# EAGLE design SND_SMD_Replacement (EAGLE 9.6.2)
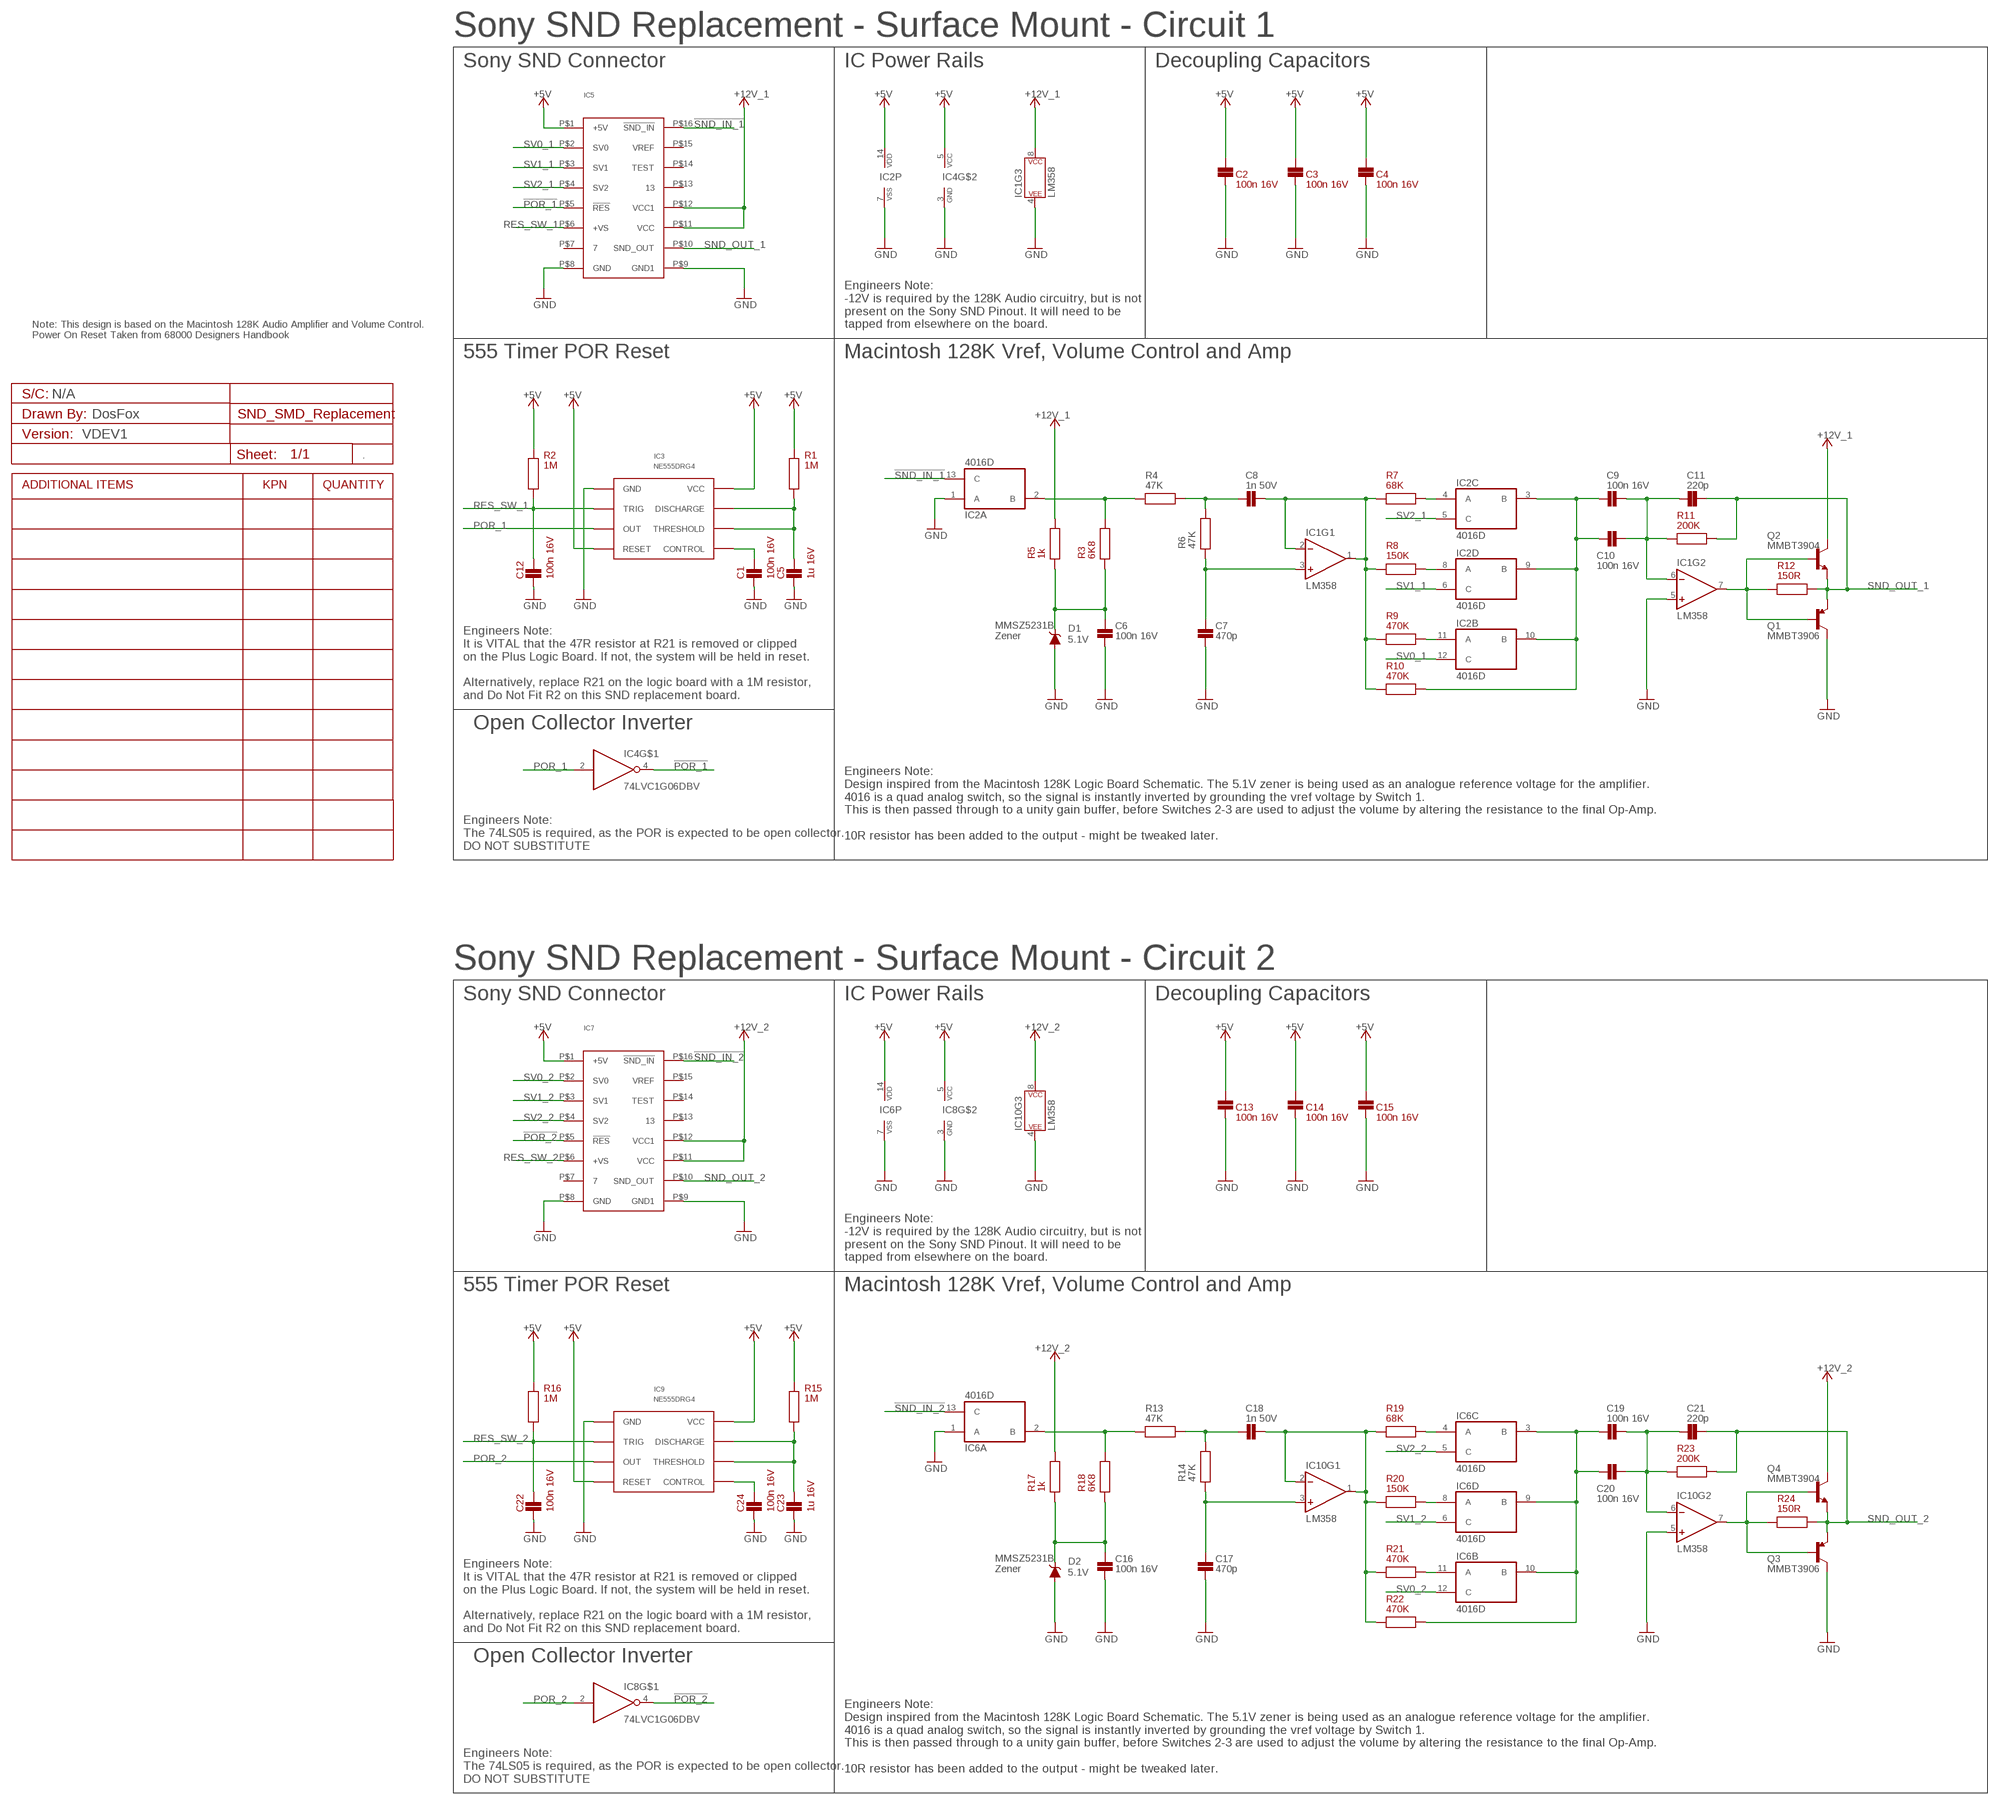
[diagram p0: schematic, sheet 1]

## Parts
A1  VDEV1  PROJECT_DETAILS_CUSTOM  [PCB_CUSTOM_DETAILS]
C1  100n 16V  100N_CAP_0603  [C0603]
C2  100n 16V  100N_CAP_0603  [C0603]
C3  100n 16V  100N_CAP_0603  [C0603]
C4  100n 16V  100N_CAP_0603  [C0603]
C5  1u 16V  1U_CAP_0603  [C0603]
C6  100n 16V  100N_CAP_0603  [C0603]
C7  470p  100P_CAP_0603  [C0603]
C8  1n 50V  10N_CAP_0603  [C0603]
C9  100n 16V  100N_CAP_0603  [C0603]
C10  100n 16V  100N_CAP_0603  [C0603]
C11  220p  100P_CAP_0603  [C0603]
C12  100n 16V  100N_CAP_0603  [C0603]
C13  100n 16V  100N_CAP_0603  [C0603]
C14  100n 16V  100N_CAP_0603  [C0603]
C15  100n 16V  100N_CAP_0603  [C0603]
C16  100n 16V  100N_CAP_0603  [C0603]
C17  470p  100P_CAP_0603  [C0603]
C18  1n 50V  10N_CAP_0603  [C0603]
C19  100n 16V  100N_CAP_0603  [C0603]
C20  100n 16V  100N_CAP_0603  [C0603]
C21  220p  100P_CAP_0603  [C0603]
C22  100n 16V  100N_CAP_0603  [C0603]
C23  1u 16V  1U_CAP_0603  [C0603]
C24  100n 16V  100N_CAP_0603  [C0603]
D1  5.1V  DIODE-ZENER-MMSZ5232BS  [SOD-323]
D2  5.1V  DIODE-ZENER-MMSZ5232BS  [SOD-323]
IC1  LM358  OPAMP-DUALU  [SO08]
IC2  4016D  [SO14]
IC3  NE555DRG4  555_SOIC8  [SOIC8]
IC4  74LVC1G06DBV  [SOT23-5]
IC5  SND  [DIP16]
IC6  4016D  [SO14]
IC7  SND  [DIP16]
IC8  74LVC1G06DBV  [SOT23-5]
IC9  NE555DRG4  555_SOIC8  [SOIC8]
IC10  LM358  OPAMP-DUALU  [SO08]
Q1  MMBT3906  TRANS_PNP-PMBT3906|MMBT3906L  [SOT23-3]
Q2  MMBT3904  TRANS_NPN-MMBT2222AL  [SOT23-3]
Q3  MMBT3906  TRANS_PNP-PMBT3906|MMBT3906L  [SOT23-3]
Q4  MMBT3904  TRANS_NPN-MMBT2222AL  [SOT23-3]
R1  1M  GENERIC_RESISTOR_0603  [R0603]
R2  1M  GENERIC_RESISTOR_0603  [R0603]
R3  6K8  GENERIC_RESISTOR_0603  [R0603]
R4  47K  47K_RESISTOR  [R0603]
R5  1k  1K_RESISTOR_0603  [R0603]
R6  47K  47K_RESISTOR  [R0603]
R7  68K  GENERIC_RESISTOR_0603  [R0603]
R8  150K  GENERIC_RESISTOR_0603  [R0603]
R9  470K  GENERIC_RESISTOR_0603  [R0603]
R10  470K  GENERIC_RESISTOR_0603  [R0603]
R11  200K  GENERIC_RESISTOR_0603  [R0603]
R12  150R  150R_RESISTOR_0603  [R0603]
R13  47K  47K_RESISTOR  [R0603]
R14  47K  47K_RESISTOR  [R0603]
R15  1M  GENERIC_RESISTOR_0603  [R0603]
R16  1M  GENERIC_RESISTOR_0603  [R0603]
R17  1k  1K_RESISTOR_0603  [R0603]
R18  6K8  GENERIC_RESISTOR_0603  [R0603]
R19  68K  GENERIC_RESISTOR_0603  [R0603]
R20  150K  GENERIC_RESISTOR_0603  [R0603]
R21  470K  GENERIC_RESISTOR_0603  [R0603]
R22  470K  GENERIC_RESISTOR_0603  [R0603]
R23  200K  GENERIC_RESISTOR_0603  [R0603]
R24  150R  150R_RESISTOR_0603  [R0603]

## Nets
!POR_1: IC4.4(O) IC5.P$5(!RES)
!POR_2: IC7.P$5(!RES) IC8.4(O)
!SND_IN_1: IC2.13(A:C) IC5.P$16(!SND_IN)
!SND_IN_2: IC6.13(A:C) IC7.P$16(!SND_IN)
+5V: C2.2 C3.2 C4.2 C13.2 C14.2 C15.2 IC2.14(P:VDD) IC3.P$4(RESET) IC3.P$8(VCC) IC4.5(VCC) IC5.P$1(+5V) IC6.14(P:VDD) IC7.P$1(+5V) IC8.5(VCC) IC9.P$4(RESET) IC9.P$8(VCC) R1.2 R2.2 R15.2 R16.2 ; supply symbol labelled VCC
+12V_1: IC1.8(P$V+) IC5.P$11(VCC) IC5.P$12(VCC1) Q2.3(C) R5.2 ; supply symbol labelled VCC
+12V_2: IC7.P$11(VCC) IC7.P$12(VCC1) IC10.8(P$V+) Q4.3(C) R17.2 ; supply symbol labelled VCC
GND: C1.1 C2.1 C3.1 C4.1 C5.1 C6.1 C7.1 C12.1 C13.1 C14.1 C15.1 C16.1 C17.1 C22.1 C23.1 C24.1 D1.A D2.A IC1.4(P$V-) IC1.5(+IN) IC2.1(A:A) IC2.7(P:VSS) IC3.P$1(GND) IC4.3(GND) IC5.P$8(GND) IC5.P$9(GND1) IC6.1(A:A) IC6.7(P:VSS) IC7.P$8(GND) IC7.P$9(GND1) IC8.3(GND) IC9.P$1(GND) IC10.4(P$V-) IC10.5(+IN) Q1.3(C) Q3.3(C)
N$1: IC2.2(A:B) R3.2 R4.1
N$2: C19.1 C20.1 IC6.3(C:B) IC6.9(D:B) IC6.10(B:B) R22.2
N$3: C9.1 C10.1 IC2.3(C:B) IC2.9(D:B) IC2.10(B:B) R10.2
N$4: C8.1 R4.2 R6.2
N$5: C6.2 D1.C R3.1 R5.1
N$6: C7.2 IC1.3(+IN) R6.1
N$7: IC2.4(C:A) R7.2
N$8: IC2.8(D:A) R8.2
N$9: IC2.11(B:A) R9.2
N$10: C9.2 C10.2 C11.1 IC1.6(-IN) R11.1
N$11: C5.2 IC3.P$6(THRESHOLD) IC3.P$7(DISCHARGE) R1.1
N$12: C8.2 IC1.1(OUT) IC1.2(-IN) R7.1 R8.1 R9.1 R10.1
N$13: IC6.2(A:B) R13.1 R18.2
N$14: C18.1 R13.2 R14.2
N$15: IC1.7(OUT) Q1.1(B) Q2.1(B) R12.1
N$16: C16.2 D2.C R17.1 R18.1
N$17: C1.2 IC3.P$5(CONTROL)
N$18: C17.2 IC10.3(+IN) R14.1
N$19: IC6.4(C:A) R19.2
N$20: IC6.8(D:A) R20.2
N$21: IC6.11(B:A) R21.2
N$22: C19.2 C20.2 C21.1 IC10.6(-IN) R23.1
N$23: IC10.7(OUT) Q3.1(B) Q4.1(B) R24.1
N$24: C18.2 IC10.1(OUT) IC10.2(-IN) R19.1 R20.1 R21.1 R22.1
N$25: C23.2 IC9.P$6(THRESHOLD) IC9.P$7(DISCHARGE) R15.1
N$26: C24.2 IC9.P$5(CONTROL)
POR_1: IC3.P$3(OUT) IC4.2(I)
POR_2: IC8.2(I) IC9.P$3(OUT)
RES_SW_1: C12.2 IC3.P$2(TRIG) IC5.P$6(+VS) R2.1
RES_SW_2: C22.2 IC7.P$6(+VS) IC9.P$2(TRIG) R16.1
SND_OUT_1: C11.2 IC5.P$10(SND_OUT) Q1.2(E) Q2.2(E) R11.2 R12.2
SND_OUT_2: C21.2 IC7.P$10(SND_OUT) Q3.2(E) Q4.2(E) R23.2 R24.2
SV0_1: IC2.12(B:C) IC5.P$2(SV0)
SV0_2: IC6.12(B:C) IC7.P$2(SV0)
SV1_1: IC2.6(D:C) IC5.P$3(SV1)
SV1_2: IC6.6(D:C) IC7.P$3(SV1)
SV2_1: IC2.5(C:C) IC5.P$4(SV2)
SV2_2: IC6.5(C:C) IC7.P$4(SV2)
Unconnected: IC5.P$7 IC5.P$13 IC5.P$14(TEST) IC5.P$15(VREF) IC7.P$7 IC7.P$13 IC7.P$14(TEST) IC7.P$15(VREF)

## Notes on the sheet
- Sony SND Replacement - Surface Mount - Circuit 1
- Sony SND Connector | IC Power Rails | Decoupling Capacitors
- Engineers Note:
  -12V is required by the 128K Audio circuitry, but is not 
  present on the Sony SND Pinout. It will need to be 
  tapped from elsewhere on the board.
- Note: This design is based on the Macintosh 128K Audio Amplifier and Volume Control. 
  Power On Reset Taken from 68000 Designers Handbook
- 555 Timer POR Reset | Macintosh 128K Vref, Volume Control and Amp
- N/A
- DosFox
- MMSZ5231B
  Zener
- Engineers Note:
  It is VITAL that the 47R resistor at R21 is removed or clipped
  on the Plus Logic Board. If not, the system will be held in reset. 
  
  Alternatively, replace R21 on the logic board with a 1M resistor,
  and Do Not Fit R2 on this SND replacement board.
- Open Collector Inverter
- Engineers Note:
  Design inspired from the Macintosh 128K Logic Board Schematic. The 5.1V zener is being used as an analogue reference voltage for the amplifier. 
  4016 is a quad analog switch, so the signal is instantly inverted by grounding the vref voltage by Switch 1. 
  This is then passed through to a unity gain buffer, before Switches 2-3 are used to adjust the volume by altering the resistance to the final Op-Amp. 
  
  10R resistor has been added to the output - might be tweaked later.
- Engineers Note:
  The 74LS05 is required, as the POR is expected to be open collector.
  DO NOT SUBSTITUTE
- Sony SND Replacement - Surface Mount - Circuit 2
- Sony SND Connector | IC Power Rails | Decoupling Capacitors
- Engineers Note:
  -12V is required by the 128K Audio circuitry, but is not 
  present on the Sony SND Pinout. It will need to be 
  tapped from elsewhere on the board.
- 555 Timer POR Reset | Macintosh 128K Vref, Volume Control and Amp
- MMSZ5231B
  Zener
- Engineers Note:
  It is VITAL that the 47R resistor at R21 is removed or clipped
  on the Plus Logic Board. If not, the system will be held in reset. 
  
  Alternatively, replace R21 on the logic board with a 1M resistor,
  and Do Not Fit R2 on this SND replacement board.
- Open Collector Inverter
- Engineers Note:
  Design inspired from the Macintosh 128K Logic Board Schematic. The 5.1V zener is being used as an analogue reference voltage for the amplifier. 
  4016 is a quad analog switch, so the signal is instantly inverted by grounding the vref voltage by Switch 1. 
  This is then passed through to a unity gain buffer, before Switches 2-3 are used to adjust the volume by altering the resistance to the final Op-Amp. 
  
  10R resistor has been added to the output - might be tweaked later.
- Engineers Note:
  The 74LS05 is required, as the POR is expected to be open collector.
  DO NOT SUBSTITUTE

## Library data of the parts
A1 = Schematic Symbols:PROJECT_DETAILS
C1-C4 C6 C9 C10 C12-C16 C19 C20 C22 C24 = Capacitors SMD:100N_CAP; COMPONENT: Capacitor; COST: =(INDIRECT(ADDRESS(ROW(),1)))*(INDIRECT(ADDRESS(ROW(),13))); EA: =VLOOKUP(INDIRECT(ADDRESS(ROW(),7)),[ProductCosts.xlsx]StockCosts!$A:$B,2,FALSE); KPN: 3106-100N; PACKAGE: 0603; PROCESS: SMD
C5 C23 = Capacitors SMD:1U_CAP; COMPONENT: Capacitor; COST: =(INDIRECT(ADDRESS(ROW(),1)))*(INDIRECT(ADDRESS(ROW(),13))); EA: =VLOOKUP(INDIRECT(ADDRESS(ROW(),7)),[ProductCosts.xlsx]StockCosts!$A:$B,2,FALSE); KPN: 3106-1U; PACKAGE: 0603; PROCESS: SMD
C7 C11 C17 C21 = Capacitors SMD:100P_CAP; COMPONENT: Capacitor; COST: =(INDIRECT(ADDRESS(ROW(),1)))*(INDIRECT(ADDRESS(ROW(),13))); EA: =VLOOKUP(INDIRECT(ADDRESS(ROW(),7)),[ProductCosts.xlsx]StockCosts!$A:$B,2,FALSE); KPN: xxxx; PACKAGE: 0603; PROCESS: SMD; VALUE: 100p
C8 C18 = Capacitors SMD:10N_CAP; COMPONENT: Capacitor; COST: =(INDIRECT(ADDRESS(ROW(),1)))*(INDIRECT(ADDRESS(ROW(),13))); EA: =VLOOKUP(INDIRECT(ADDRESS(ROW(),7)),[ProductCosts.xlsx]StockCosts!$A:$B,2,FALSE); KPN: 3106-10N; PACKAGE: 0603; PROCESS: SMD; VALUE: 10n 50V
D1 D2 = SparkFun-DiscreteSemi:DIODE-ZENER: Zener Diode A Zener diode allows current to flow from its anode to its cathode like a normal semiconductor diode, but it also permits current to flow in the reverse direction when its "Zener voltage" is reached. - WIkipedia; PROD_ID: DIO-12442; VALUE: 5.6V
IC1 IC10 = SparkFun-IC-Amplifiers:OPAMP-DUAL: Generic op-amp footprint This component is for the standard 358 pinning of a dual op-amp From the LM358 datasheet: Pin 1: Output A Pin 2: Inverting Input A Pin 3: Non-Inverting Input A Pin 4: Gnd Pin 5: Non-Inverting Input B Pin 6: Inverting Input B Pin 7: Output B Pin 8: V+; PROD_ID: NA-XXXXX; VALUE: OP-AMP
IC2 IC6 = 40xx:4016: Quad bilateral ANALOG SWITCH
IC3 IC9 = ICs:555; COMPONENT: 555 Timer; COST: =(INDIRECT(ADDRESS(ROW(),1)))*(INDIRECT(ADDRESS(ROW(),13))); EA: =VLOOKUP(INDIRECT(ADDRESS(ROW(),7)),[ProductCosts.xlsx]StockCosts!$A:$B,2,FALSE); KPN: xxxxx; MANUFACTURE: Texas Instruments; PACKAGE: SOIC8; PROCESS: SMD
IC4 IC8 = 74xx-little-us:74*1G06: Single Inverter Buffer/Driver With Open-Drain Output
IC5 IC7 = ICs:SND; PACKAGE: DIP16; PROCESS: TH
Q1 Q3 = SparkFun-DiscreteSemi:TRANS_PNP: PNP transistor Current controlled devices typically used to amplify current or used as a switch. SparkFun Products: SparkFun Serial Enabled 16x2 LCD - Red on Black <https://www.sparkfun.com/products/9068> SparkFun Logomatic <https://www.sparkfun.com/products/12772>; PROD_ID: TRANS-08052; VALUE: 200mA/40V
Q2 Q4 = SparkFun-DiscreteSemi:TRANS_NPN: NPN transistor Current controlled devices typically used to amplify current or used as a switch. BC547 - COM-08928 <http://www.sparkfun.com/products/8928> (TO-92 45V 100mA) (1.Collector 2.Base 3.Emitter) 2N3904 - COM-00521 <http://www.sparkfun.com/products/521> (TO-92 40V 200mA) (1.Emitter 2.Base 3.Collector) P2N2222A - COM-12852 <http://www.sparkfun.com/products/12852> (TO-92 40V 600mA) (1.Collector 2.Base 3.Emitter); PROD_ID: TRANS-08049; VALUE: 600mA/40V
R1-R3 R7-R11 R15 R16 R18-R23 = Resistors SMD:GENERIC_RESISTOR; COMPONENT: Resistor; COST: =(INDIRECT(ADDRESS(ROW(),1)))*(INDIRECT(ADDRESS(ROW(),13))); EA: =VLOOKUP(INDIRECT(ADDRESS(ROW(),7)),[ProductCosts.xlsx]StockCosts!$A:$B,2,FALSE); PACKAGE: 0603; PROCESS: SMD
R4 R6 R13 R14 = Resistors SMD:47K_RESISTOR; COMPONENT: Resistor; COST: =(INDIRECT(ADDRESS(ROW(),1)))*(INDIRECT(ADDRESS(ROW(),13))); EA: =VLOOKUP(INDIRECT(ADDRESS(ROW(),7)),[ProductCosts.xlsx]StockCosts!$A:$B,2,FALSE); KPN: 3014-47K; PACKAGE: 0603; PROCESS: SMD
R5 R17 = Resistors SMD:1K_RESISTOR; COMPONENT: Resistor; COST: =(INDIRECT(ADDRESS(ROW(),1)))*(INDIRECT(ADDRESS(ROW(),13))); EA: =VLOOKUP(INDIRECT(ADDRESS(ROW(),7)),[ProductCosts.xlsx]StockCosts!$A:$B,2,FALSE); KPN: 3014-1K; PACKAGE: 0603; PROCESS: SMD
R12 R24 = Resistors SMD:150R_RESISTOR; COMPONENT: Resistor; COST: =(INDIRECT(ADDRESS(ROW(),1)))*(INDIRECT(ADDRESS(ROW(),13))); EA: =VLOOKUP(INDIRECT(ADDRESS(ROW(),7)),[ProductCosts.xlsx]StockCosts!$A:$B,2,FALSE); KPN: 3013-150R; PACKAGE: 0603; PROCESS: SMD

## Board
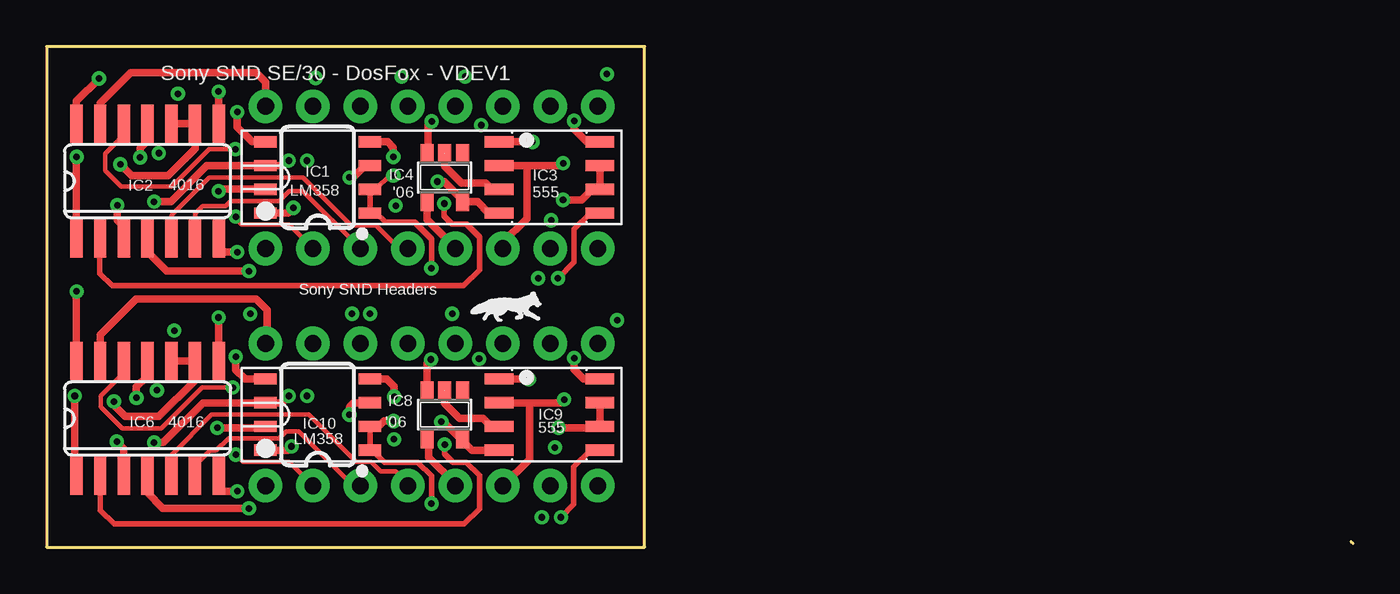
[diagram p1: board, top side]
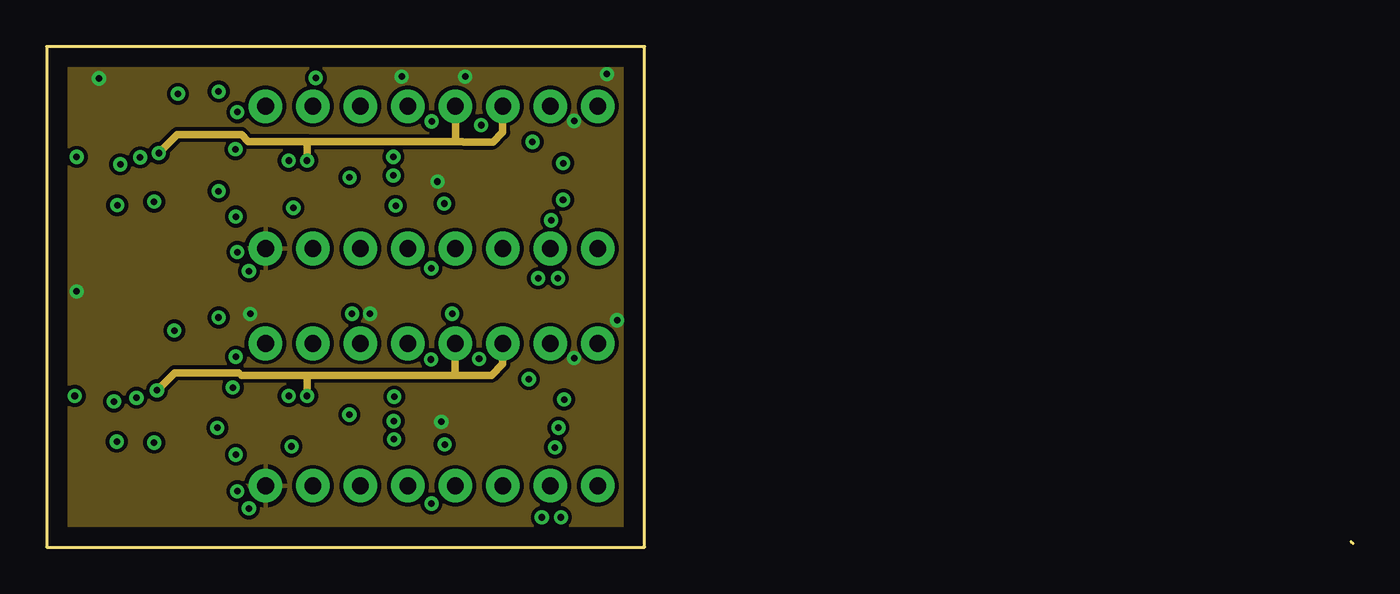
[diagram p2: board, inner layer Route2]
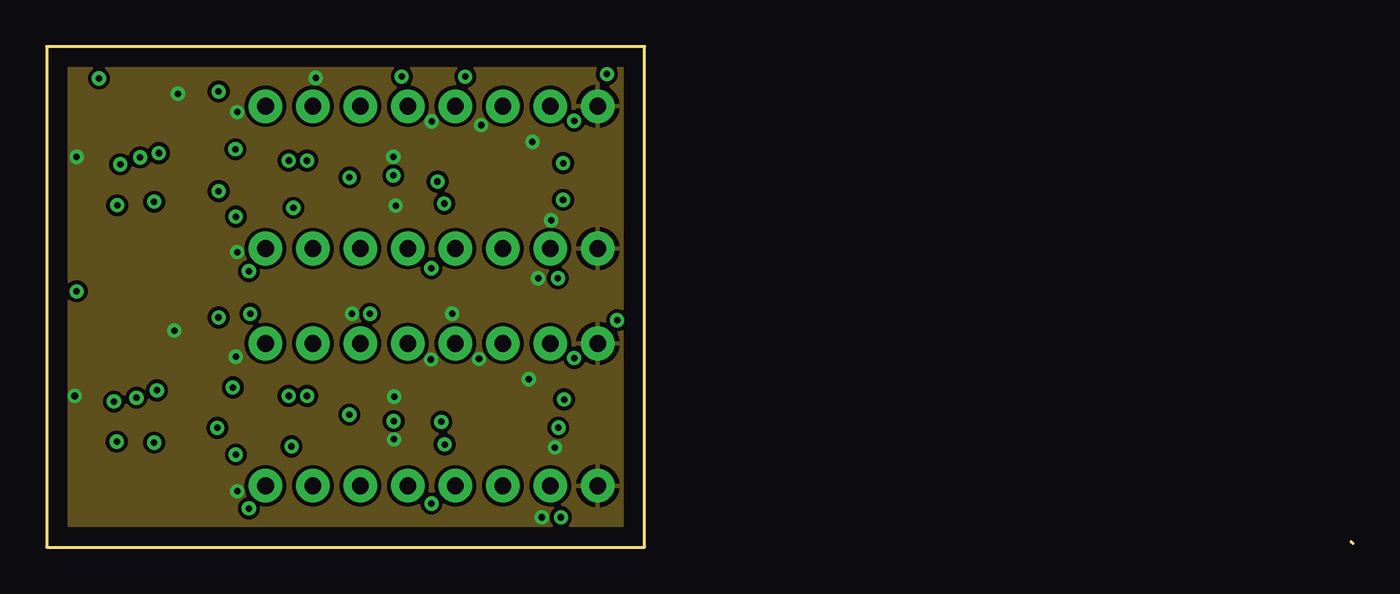
[diagram p3: board, inner layer Route15]
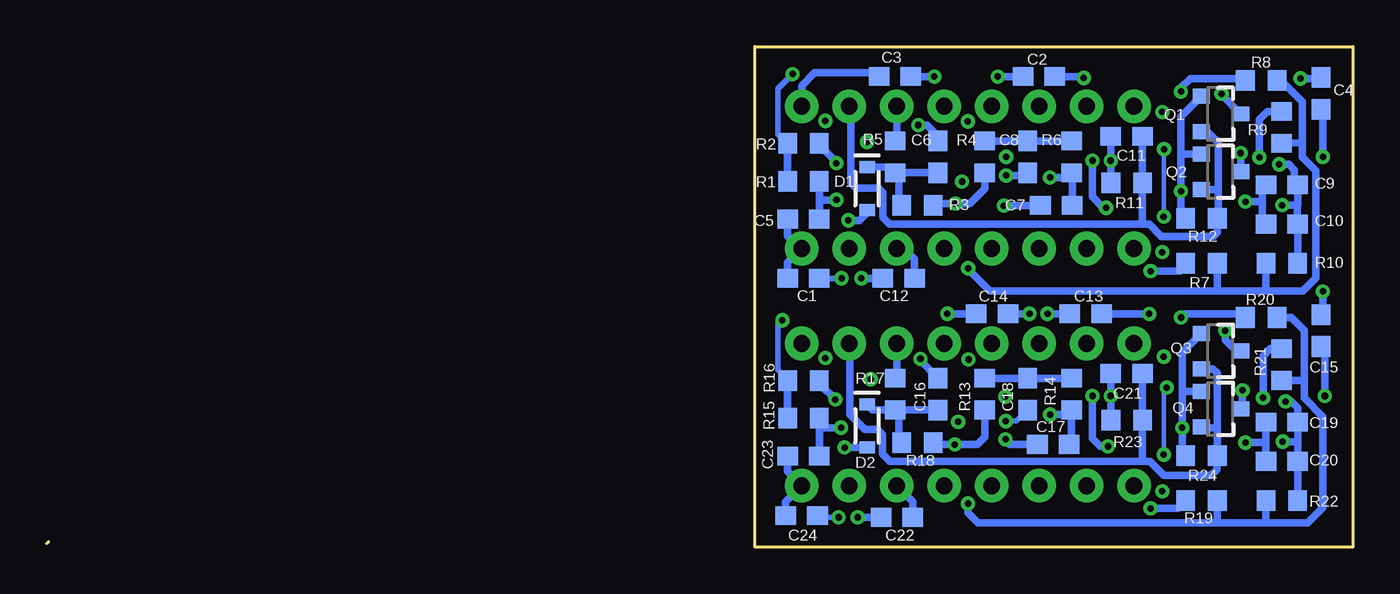
[diagram p4: board, bottom side, seen from below]

Size 69.9 x 26.8 mm. Coordinates in mm from the lower left corner, seen from the top.
Outline: 69.8,0.3 69.9,0.2
Outline: 0,0 32,0 32,26.8 0,26.8 0,0
Copper layers (1+2*15+16): Top 0.035mm / dielectric 1.5mm / Route2 0.035mm / dielectric 0.15mm / Route15 0.035mm / dielectric 0.2mm / Bottom 0.035mm
Design rules "default *": minimum track width 0.2mm, minimum drill 0.25mm, track to track 8mil, track to pad 8mil, pad to pad 8mil, via to via 8mil, smd to smd 8mil, copper to edge 40mil, drill to drill 8mil, minimum pad ring 1mil, minimum via ring 8mil, stop-mask expansion 4mil, vias tented up to drill 1mm, thermal gap 10mil

### Footprints (pad centres in the part's own frame; a part is rotated, then mirrored left to right if it is on the bottom)
C0603 = smd 1.1 x 1: 1 -0.85,0; 2 0.85,0
SOD-323 = smd 0.63 x 0.83: A 1.15,0; C -1.15,0
SO08 = smd 0.6 x 1.2: 1 -1.905,-2.8; 2 -0.635,-2.8; 3 0.635,-2.8; 4 1.905,-2.8; 5 1.905,2.8; 6 0.635,2.8; 7 -0.635,2.8; 8 -1.905,2.8
SO14 = smd 0.66 x 2.032: 1 -3.81,-3.073; 2 -2.54,-3.073; 3 -1.27,-3.073; 4 0,-3.073; 5 1.27,-3.073; 6 2.54,-3.073; 7 3.81,-3.073; 8 3.81,3.073; 9 2.54,3.073; 10 1.27,3.073; 11 0,3.073; 12 -1.27,3.073; 13 -2.54,3.073; 14 -3.81,3.073
SOIC8 = smd 1.55 x 0.6: P$1 -2.7,1.905; P$2 -2.7,0.635; P$3 -2.7,-0.635; P$4 -2.7,-1.905; P$5 2.7,-1.905; P$6 2.7,-0.635; P$7 2.7,0.635; P$8 2.7,1.905
SOT23-5 = smd 0.69 x 0.99: 1 -0.95,-1.29; 2 0,-1.29; 3 0.95,-1.29; 4 0.95,1.3; 5 -0.95,1.3
DIP16 = drill 0.9 pad 1.8: P$1 -8.89,-3.81; P$2 -6.35,-3.81; P$3 -3.81,-3.81; P$4 -1.27,-3.81; P$5 1.27,-3.81; P$6 3.81,-3.81; P$7 6.35,-3.81; P$8 8.89,-3.81; P$9 8.89,3.81; P$10 6.35,3.81; P$11 3.81,3.81; P$12 1.27,3.81; P$13 -1.27,3.81; P$14 -3.81,3.81; P$15 -6.35,3.81; P$16 -8.89,3.81
SOT23-3 = smd 0.8 x 0.9: 1 -0.95,-1; 2 0.95,-1; 3 0,1.1
R0603 = smd 1 x 1.1: 1 -0.85,0; 2 0.85,0

### Placement (x,y rotation side)
A1  -120.65,1.67 0 top  (outside the outline)
C1  29.4,14.4 0 bottom
C2  16.8,25.2 180 bottom
C3  24.5,25.2 0 bottom
C4  1.7,24.3 90 bottom
C5  29.4,17.57 0 bottom
C6  22.2,20.9 270 bottom
C7  15.87,18.3 0 bottom
C8  17.4,20.9 270 bottom
C9  3.8,19.4 180 bottom
C10  3.8,17.3 180 bottom
C11  12.1,22 0 bottom
C12  24.3,14.4 0 bottom
C13  14.3,12.5 0 bottom
C14  19.3,12.5 0 bottom
C15  1.7,11.6 90 bottom
C16  22.2,8.2 270 bottom
C17  16.03,5.51 0 bottom
C18  17.4,8.2 270 bottom
C19  3.8,6.7 180 bottom
C20  3.8,4.6 180 bottom
C21  12.1,9.3 0 bottom
C22  24.4,1.6 0 bottom
C23  29.4,4.88 0 bottom
C24  29.5,1.7 0 bottom
D1  26,19.2 270 bottom
D2  26,6.5 270 bottom
IC1  14.5,19.8 90 top
IC2  5.4,19.6 0 top
IC3  26.9,19.8 0 top
IC4  21.3,19.8 180 top
IC5  20.6,19.8 0 top
IC6  5.4,6.9 0 top
IC7  20.6,7.1 0 top
IC8  21.3,7.1 180 top
IC9  26.9,7.1 0 top
IC10  14.5,7.1 90 top
Q1  7.1,23.2 270 bottom
Q2  7.1,20.1 270 bottom
Q3  7.1,10.5 270 bottom
Q4  7.1,7.4 270 bottom
R1  29.4,19.6 180 bottom
R2  29.4,21.62 180 bottom
R3  23.3,18.3 0 bottom
R4  19.7,20.9 90 bottom
R5  24.5,20.9 90 bottom
R6  15.05,20.9 90 bottom
R7  8.1,15.2 180 bottom
R8  4.9,25 180 bottom
R9  3.81,22.48 90 bottom
R10  3.8,15.2 0 bottom
R11  12.1,19.5 0 bottom
R12  8.1,17.6 0 bottom
R13  19.7,8.2 90 bottom
R14  15.05,8.2 90 bottom
R15  29.4,6.9 180 bottom
R16  29.4,8.92 180 bottom
R17  24.5,8.2 90 bottom
R18  23.3,5.6 0 bottom
R19  8.1,2.5 180 bottom
R20  4.9,12.3 180 bottom
R21  3.81,9.78 90 bottom
R22  3.8,2.5 0 bottom
R23  12.1,6.8 0 bottom
R24  8.1,4.9 0 bottom

### Tracks (layer width: path | path; a pad name or v marks a point on that pad's centre or on a via)
!POR_1
  Top 0.406: IC5.P$5 21.87,16.02 20.35,17.54 IC4.4
!POR_2
  Top 0.406: IC7.P$5 21.87,3.39 20.45,4.81 20.45,5.7 IC8.4
!SND_IN_1
  Top 0.406: IC5.P$16 11.71,24.91 11.21,25.41 4.5,25.41 2.86,23.77 IC2.13
!SND_IN_2
  Top 0.406: IC6.13 2.86,11.36 4.8,13.3 11.2,13.3 11.8,12.7 11.8,11 IC7.P$16
+5V  (via drill 0.35)
  Top 0.406: IC3.P$4 23.66,17.89 23.05,18.5 IC4.5 22.25,18.6 21.27,19.58 v20.91,19.58 | IC2.14 1.59,23.89 v2.8,25.1 | v28.23,22.83 28.23,22.37 28.9,21.7 IC3.P$8 | IC6.14 v1.59,13.69 v1.6,13.7 | IC9.P$8 28.74,9.01 28.74,9.02 28.23,9.53 v28.23,10.13 | IC9.P$4 22.75,5.2 22.25,5.7 | 22.25,5.7 IC8.5 | 22.25,5.7 21.23,6.71 v21.12,6.71
  Bottom 0.305: v29.98,25.33 30.75,24.55 30.75,22.12 R2.2 | R16.2 30.25,9.02 30.75,9.49 30.75,11.93 v30.53,12.15
  Bottom 0.406: C4.2 1.85,25.1 v2.8,25.1 | 22.39,25.21 v22.4,25.2 C3.2 | R2.2 R1.2 30.16,19.51 | v19,25.2 C2.2 | v1.6,13.7 1.6,12.55 C15.2 | R16.2 R15.2 | C14.2 v17.3,12.5 | C13.2 v10.9,12.5 v10.89,12.49
  pour Route2: 32,26.8 32,0 0,0 0,26.8
+12V_1  (via drill 0.35)
  Top 0.406: IC1.8 12.93,17.89 v13.2,18.17
  Route2 0.406: IC5.P$12 21.87,21.73 | 13.94,21.73 21.87,21.73 | 21.87,21.73 22.27,21.73 22.3,21.7 23.89,21.7 24.41,22.22 IC5.P$11 | v6,21.1 6.99,22.09 10.43,22.09 10.79,21.73 13.94,21.73 | v13.94,20.7 13.94,21.73
  Bottom 0.406: v6,21.1 Q2.3 | IC5.P$11 24.41,21.84 R5.2 | v13.2,18.17 13.35,18.17 13.94,18.76 v13.94,20.7
+12V_2  (via drill 0.35)
  Top 0.406: IC10.8 12.89,5.2 v13.1,5.4
  Route2 0.406: IC7.P$12 21.85,10.89 21.85,9.23 21.82,9.2 | 21.82,9.2 14,9.2 | 14,9.2 10.42,9.2 10.28,9.34 6.84,9.34 v5.9,8.4 | IC7.P$11 24.41,9.81 23.8,9.2 21.82,9.2 | v13.94,8.1 13.94,9.13 14,9.2
  Bottom 0.406: IC7.P$11 24.41,9.14 R17.2 | Q4.3 5.9,7.5 v5.9,8.4 | v13.1,5.4 13.5,5.4 13.94,5.83 v13.94,8.1
GND  (via drill 0.35)
  Top 0.305: 20.4,21.14 IC4.3
  Top 0.406: v10.2,15.8 9.21,15.8 IC2.7 | IC3.P$1 v26,21.7 | IC1.5 10.99,21.7 10.2,22.5 v10.2,23.3 | v1.6,20.9 v1.59,20.89 IC2.1 | v20.6,22.8 20.4,22.6 20.4,21.14 | v18.55,20.9 18.55,21.4 18.25,21.7 IC1.4 | v1.5,8.1 1.5,3.92 IC6.1 | IC6.7 9.21,3 v10.2,3 | IC10.5 10.62,9.01 10.12,9.5 v10.12,10.2 | IC8.3 20.35,9.84 v20.57,10.05 | IC9.P$1 v25.8,9.01 v25.8,9 | IC10.4 18.2,9.01 18.6,8.6 v18.6,8.06
  Route2 0.406: v18.6,8.06 18.58,8.06
  Bottom 0.305: 25.9,17.95 D1.A
  Bottom 0.406: v7.02,24.28 7.02,24.22 Q1.3 | v18.68,18.28 16.7,18.28 C7.1 | v23.25,22.6 22.8,22.6 22.2,22 C6.1 | C4.1 1.6,23.35 v1.6,20.9 | C5.1 30.25,16.65 IC5.P$8 30.25,15.23 C1.1 | C3.1 25.55,25.4 28.8,25.4 29.49,24.71 IC5.P$9 | C2.1 14.47,25.2 v14.4,25.13 | D1.A 26,17.9 26.4,17.5 v27,17.5 | C12.1 v26.3,14.4 | C22.1 v26.5,1.6 | C24.1 30.35,2.43 IC7.P$8 30.25,4.05 C23.1 | C15.1 1.5,10.55 v1.5,8.1 | C14.1 v21.7,12.5 | C13.1 v16.34,12.5 | C16.1 23.14,9.99 v23.14,10.09 | D2.A v27.2,5.34 | v6.83,11.6 6.83,11.1 6.23,10.5 Q3.3 | C17.1 18.38,5.51 18.59,5.72 v18.59,5.78
  pour Route15: 0,26.8 0,0 32,0 32,26.8
N$1  (via drill 0.35)
  Top 0.305: IC2.2 2.84,16.51 2.84,14.66 3.51,14 22.3,14 23.15,14.85 23.15,16.61 22.46,17.3 21.7,17.3 21.28,17.72 v21.28,18.4
  Bottom 0.406: R4.1 19.7,19.2 20.5,18.4 v21.28,18.4 22.35,18.4 R3.2
N$2  (via drill 0.35)
  Top 0.406: IC6.10 IC6.9 7.94,8.94 6,7 4.2,7 3.6,7.6 v3.6,7.8 | IC6.3 4.13,5.27 v3.75,5.65
  Bottom 0.406: R22.2 C20.1 2.95,5.6 | v3.6,7.8 3.3,7.8 2.95,7.45 C19.1 2.95,5.6 | 2.95,5.6 3,5.65 v3.75,5.65
N$3  (via drill 0.35)
  Top 0.406: IC2.10 IC2.9 7.94,21.33 6.5,19.89 4.55,19.89 v3.94,20.5 | IC2.3 4.13,17.14 3.78,17.51 v3.78,18.31
  Bottom 0.406: v3.94,20.5 3.44,20.5 3.14,20.2 3.14,19.59 C9.1 2.95,18.32 2.97,18.32 | R10.2 C10.1 2.97,18.32 | v3.78,18.31 2.98,18.31 2.97,18.32
N$4
  Bottom 0.406: R6.2 C8.1 R4.2
N$5
  Bottom 0.406: D1.C 24.8,20.35 R5.1 | R5.1 C6.2 | R5.1 24.3,19.85 24.3,18.45 R3.1
N$6  (via drill 0.35)
  Top 0.406: v16.21,19.8 16.41,19.8 17.05,20.43 IC1.3
  Bottom 0.406: C7.2 15.02,20.02 R6.1 15.3,19.8 v16.21,19.8
N$7  (via drill 0.35)
  Top 0.406: IC2.4 5.4,15.8 6.42,14.78 v10.82,14.78
  Bottom 0.406: v10.82,14.78 9.22,14.78 8.95,15.05 R7.2
N$8  (via drill 0.35)
  Top 0.406: v9.2,24.4 v9.21,24.39 IC2.8
  Bottom 0.406: R8.2 5.85,25.1 8.7,25.1 9.2,24.6 v9.2,24.4
N$9  (via drill 0.35)
  Top 0.406: IC2.11 5.4,21.77 5,21.37 v5,20.88
  Bottom 0.406: v5,20.88 5,22.9 4.57,23.33 R9.2
N$10  (via drill 0.35)
  Top 0.406: v5.75,18.5 6.65,18.5 8.57,20.42 11.69,20.42 IC1.6 12.69,20.43 v12.95,20.7
  Bottom 0.406: R11.1 v12.95,20.7 C11.1 | C9.2 4.85,19.2 4.85,18.5 | 4.85,18.5 4.85,17.5 C10.2 | 4.85,18.5 v5.75,18.5
N$11  (via drill 0.35)
  Top 0.406: IC3.P$7 IC3.P$6 29.2,19.16 28.64,18.6 v27.64,18.6
  Bottom 0.406: R1.1 28.55,18.6 | 28.55,18.6 C5.2 | v27.64,18.6 28.55,18.6
N$12  (via drill 0.35)
  Top 0.254: v18.55,19.9 18.35,19.9 17.61,19.16 IC1.2
  Top 0.305: v20.59,14.93 20.59,16.51 19.7,17.4 18.14,17.4 17.64,17.89 IC1.1 IC1.2
  Bottom 0.406: R9.1 2.78,21.65 2.71,21.59 | 4.65,13.71 2.67,13.71 1.99,14.43 1.99,20.17 2.71,20.89 2.71,21.59 | R7.1 7.25,13.75 7.21,13.71 | R10.1 4.65,13.71 | 7.21,13.71 19.41,13.71 20.59,14.89 v20.59,14.93 | R8.1 3.85,25 2.71,23.86 2.71,21.59 | v18.55,19.9 17.55,19.9 C8.2 | 7.21,13.71 4.65,13.71
N$13  (via drill 0.35)
  Top 0.305: IC6.2 2.86,1.99 3.6,1.25 22.34,1.25 23.15,2.05 23.15,3.85 22.45,4.55 21.76,4.55 21.3,5.01 v21.3,5.5
  Bottom 0.406: R13.1 19.7,5.9 20.1,5.5 v21.3,5.5 22.35,5.5 R18.2
N$14
  Bottom 0.406: R13.2 C18.1 R14.2
N$15  (via drill 0.35)
  Top 0.406: IC1.7 9.3,19.16 v9.2,19.07
  Bottom 0.406: v9.2,19.07 9.2,21.05 Q2.1 | Q1.1 9.2,23.05 v9.2,19.07 | v9.2,19.07 9.2,18.1 R12.1
N$16
  Bottom 0.406: C16.2 24.3,7.35 | 24.3,7.35 R17.1 25.7,7.35 D2.C | R18.1 24.3,5.75 24.3,7.35
N$17  (via drill 0.35)
  Top 0.305: IC3.P$5 29.1,17.89 28.23,17.03 28.23,15.28 v27.36,14.4
  Bottom 0.305: v27.36,14.4 C1.2
N$18  (via drill 0.35)
  Top 0.406: v16.2,7.1 16.2,7.5 16.43,7.74 IC10.3
  Bottom 0.406: v16.2,7.1 15.05,7.1 R14.1 15.05,5.64 C17.2
N$19  (via drill 0.35)
  Top 0.406: IC6.4 5.4,2.9 6.22,2.08 v10.82,2.08
  Bottom 0.406: v10.82,2.08 9.37,2.08 R19.2
N$20  (via drill 0.35)
  Top 0.406: v9.2,12.3 v9.21,12.29 IC6.8
  Bottom 0.406: R20.2 5.85,12.3 6.05,12.5 9,12.5 v9.2,12.3
N$21  (via drill 0.35)
  Top 0.406: IC6.11 5.4,9.17 4.8,8.57 v4.8,8
  Bottom 0.406: v4.8,8 4.8,10.24 4.41,10.63 R21.2
N$22  (via drill 0.35)
  Top 0.406: v12.95,8.1 12.59,7.74 IC10.6 8.38,7.73 6.25,5.6 v5.75,5.6
  Bottom 0.406: C21.1 v12.95,8.1 R23.1 | C19.2 4.65,5.6 | 4.65,5.6 C20.2 | 4.65,5.6 v5.75,5.6
N$23  (via drill 0.35)
  Top 0.406: IC10.7 11.63,6.39 v9.13,6.39
  Bottom 0.406: R24.1 9.13,5.08 v9.13,6.39 9.13,8.3 | 9.13,8.3 9.13,10.42 Q3.1 | Q4.1 9.08,8.35 9.13,8.3
N$24  (via drill 0.35)
  Top 0.305: IC10.2 IC10.1 17.43,5.2 18.08,4.55 19.85,4.55 20.59,3.81 v20.59,2.34 v20.59,2.33
  Top 0.406: v18.57,6.75 18.05,6.75 17.77,6.46 IC10.2
  Bottom 0.305: C18.2 18,6.75 v18.57,6.75 | C18.2
  Bottom 0.406: R20.1 3.3,12.3 2.61,11.61 2.61,8.9 | 2.61,8.9 2.61,8 1.6,6.99 1.6,2.1 2.4,1.29 4.6,1.29 | 4.6,1.29 7.2,1.29 | R21.1 2.64,8.93 2.61,8.9 | R22.1 4.65,1.34 4.6,1.29 | R19.1 7.25,1.34 7.2,1.29 | v20.59,2.33 20.59,1.83 20.05,1.29 7.2,1.29
N$25  (via drill 0.35)
  Top 0.406: v27.39,6.4 29.54,6.4 IC9.P$6 IC9.P$7
  Bottom 0.406: C23.2 R15.1 28.55,6.4 v27.39,6.4
N$26  (via drill 0.35)
  Top 0.305: IC9.P$5 29.09,5.2 28.21,4.31 28.21,2.29 v27.52,1.6
  Bottom 0.305: C24.2 28.55,1.6 v27.52,1.6
POR_1
  Top 0.406: IC3.P$3 24.16,19.2 23.8,19.2 23.5,19.5 22.21,19.5 21.3,20.41 IC4.2
POR_2
  Top 0.406: IC8.2 21.3,7.7 22.1,6.9 23.36,6.9 23.8,6.46 IC9.P$3
RES_SW_1  (via drill 0.35)
  Top 0.406: 25.7,20.43 IC3.P$2 | 25.7,20.43 25.7,17.6 24.41,16.31 IC5.P$6 | v27.64,20.56 27.51,20.43 25.7,20.43
  Bottom 0.406: IC5.P$6 24.01,15.99 23.45,15.43 C12.2 | v27.64,20.56 27.61,20.59 28.55,21.52 R2.1
RES_SW_2  (via drill 0.35)
  Top 0.406: IC9.P$2 25.84,7.74 | v27.69,7.91 27.54,7.74 25.84,7.74 | 25.84,7.74 25.84,4.71 IC7.P$6
  Bottom 0.406: R16.1 28.55,8.75 v27.69,7.91 | C22.2 23.55,2.43 IC7.P$6
SND_OUT_1
  Bottom 0.406: Q1.2 7.78,22.25 7.2,21.68 7.2,19.15 | 7.2,19.15 Q2.2 | 7.2,19.15 7.2,17.65 R12.2 7.25,16.85 7.46,16.64 10.23,16.64 10.89,17.3 11.28,17.3 | C11.2 R11.2 11.25,17.34 11.28,17.3 | IC5.P$10 26.85,23.51 26.85,19.5 26.58,19.23 25.39,19.23 25.16,19 25.16,17.66 24.8,17.3 11.28,17.3
SND_OUT_2
  Bottom 0.406: Q3.2 7.48,9.56 7.24,9.32 7.24,7.78 7.25,7.78 7.25,6.4 | 7.25,6.4 R24.2 7.28,4.87 7.28,4.16 7.59,3.84 10.12,3.84 10.87,4.6 11.2,4.6 | Q4.2 8.05,6.4 7.25,6.4 | C21.2 R23.2 11.25,4.65 11.2,4.6 | 11.2,4.6 24.77,4.6 25.18,5 25.18,6.03 25.45,6.3 26.1,6.3 26.9,7.1 26.9,10.86 IC7.P$10
SV0_1  (via drill 0.35)
  Top 0.254: IC2.12 4.13,22.07 3.13,21.07 3.13,20.17 3.99,19.31 6.7,19.31 8.7,21.31 v10.1,21.31 | IC5.P$2 12.97,17.27 10.44,17.27 10.12,17.58 v10.12,17.7
  Bottom 0.254: v10.1,21.31 10.1,17.72 v10.12,17.7
SV0_2  (via drill 0.35)
  Top 0.254: IC7.P$2 12.97,4.57 10.52,4.57 v10.12,4.96 | v9.96,8.55 8.31,8.55 6.12,6.37 4.03,6.37 2.89,7.51 2.89,8.09 4.13,9.33 IC6.12
  Bottom 0.254: v10.12,4.96 10.12,8.39 v9.96,8.55
SV1_1
  Top 0.254: IC5.P$3 13.7,19.08 12.98,19.08 12.44,18.54 9.84,18.54 9.57,18.27 8.34,18.27 7.94,17.87 IC2.6
SV1_2
  Top 0.254: IC6.6 7.94,4.37 8.74,5.17 9.07,5.17 9.73,5.83 12.44,5.83 12.8,6.2 13.48,6.2 16.39,3.29 IC7.P$3
SV2_1
  Top 0.254: IC5.P$4 19.03,15.99 18.88,15.97 17.63,17.23 16.3,17.23 13.73,19.8 8.71,19.8 6.7,17.79 6.7,16.56 IC2.5
SV2_2
  Top 0.254: IC7.P$4 19.33,3.4 18.67,4.06 17.88,4.06 17.38,4.57 16.56,4.57 14.03,7.1 8.84,7.1 6.68,4.94 IC6.5

### Text on the board
tNames: Sony SND SE/30 - DosFox - VDEV1 | 4016 | LM358 | '06 | IC3 / 555 | Sony SND Headers | 4016 | LM358 | '06 | 555
tDocu: RP2040 Development Board | Yes | Yes | 32 x 14mm | Yes | 2 | Yes | Yes | Yes | No | HASL (Lead Free) | Yes | Green (Both Sides) | Yes | White (Both Sides) | Yes | Yes | Yes | No | No | No